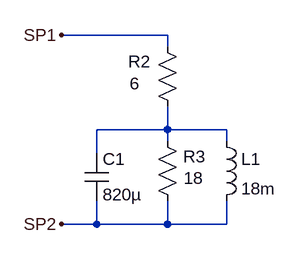
[diagram p0: schematic Parlante.asc]
Parlante.asc, the LTspice schematic file:
Version 4
SHEET 1 880 728
WIRE 464 416 464 384
WIRE 464 512 416 512
WIRE 464 512 464 480
WIRE 560 256 416 256
WIRE 560 272 560 256
WIRE 560 384 464 384
WIRE 560 384 560 352
WIRE 560 400 560 384
WIRE 560 512 464 512
WIRE 560 512 560 480
WIRE 640 384 560 384
WIRE 640 400 640 384
WIRE 640 512 560 512
WIRE 640 512 640 480
FLAG 416 256 SP1
FLAG 416 512 SP2
SYMBOL res 544 256 R0
WINDOW 0 -37 36 Left 0
WINDOW 3 -35 66 Left 0
SYMATTR InstName R2
SYMATTR Value 6
SYMBOL res 544 384 R0
WINDOW 0 37 37 Left 0
WINDOW 3 38 66 Left 0
SYMATTR InstName R3
SYMATTR Value 18
SYMBOL cap 448 416 R0
SYMATTR InstName C1
SYMATTR Value 820µ
SYMBOL ind 624 384 R0
SYMATTR InstName L1
SYMATTR Value 18m

The netlist it stands for:
* Parlante.asc
R2 SP1 N001 6
R3 N001 SP2 18
C1 N001 SP2 820µ
L1 N001 SP2 18m
.backanno
.end